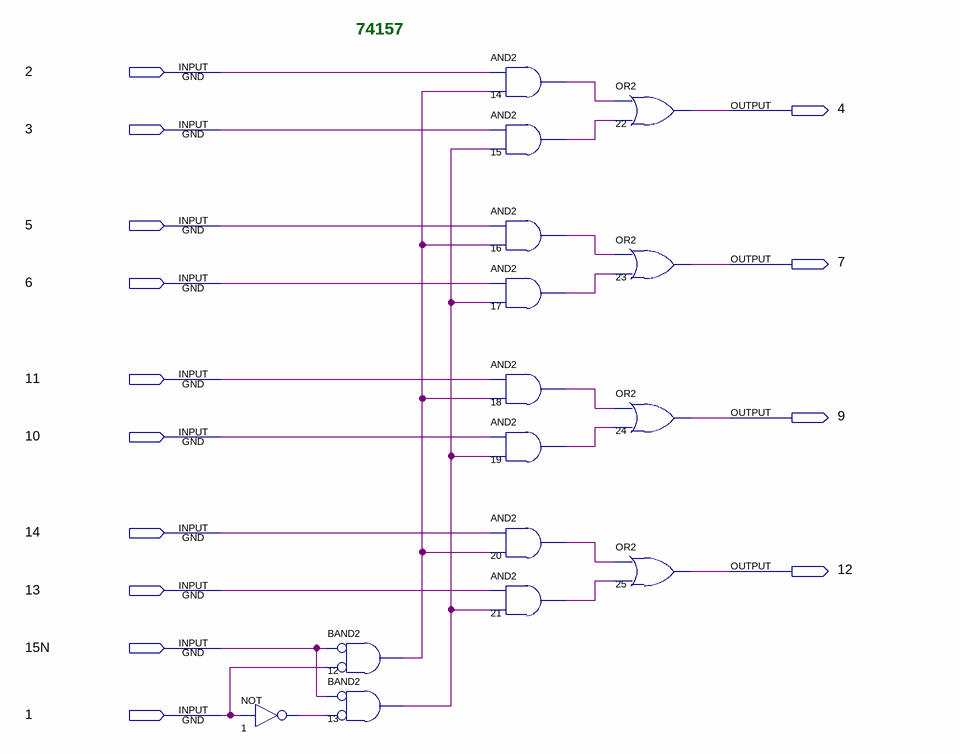
[diagram p0: schematic sheet]
// Quartus schematic 74LS157.bdf as structural Verilog: 15 symbols, 14 pins
module \74LS157  (
  input  \2 ,
  input  \3 ,
  input  \5 ,
  input  \6 ,
  input  \11 ,
  input  \10 ,
  input  \14 ,
  input  \13 ,
  input  \15N ,
  input  \1 ,
  output \4 ,
  output \7 ,
  output \9 ,
  output \12 
);

  wire n1_out, n12_out, n13_out, n14_out, n15_out, n16_out, n17_out, n18_out, n19_out, n20_out, n21_out;

  not u_1 (n1_out, \1 );
  and u_12 (n12_out, ~\15N , ~\1 );  // BAND2
  and u_13 (n13_out, ~\15N , ~n1_out);  // BAND2
  and u_14 (n14_out, \2 , n12_out);
  and u_15 (n15_out, \3 , n13_out);
  and u_16 (n16_out, \5 , n12_out);
  and u_17 (n17_out, \6 , n13_out);
  and u_18 (n18_out, \11 , n12_out);
  and u_19 (n19_out, \10 , n13_out);
  and u_20 (n20_out, \14 , n12_out);
  and u_21 (n21_out, \13 , n13_out);
  or u_22 (\4 , n14_out, n15_out);
  or u_23 (\7 , n16_out, n17_out);
  or u_24 (\9 , n18_out, n19_out);
  or u_25 (\12 , n20_out, n21_out);

  // Notes on the sheet:
  //   74157
endmodule
